# Altium project MCU.PrjPcb
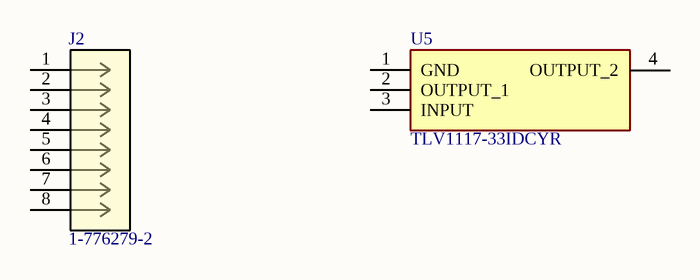
[diagram p0: Power.SchDoc]
4 sheets, 62 parts. Net scope: hierarchical (ports join the sheet entries above them; power ports are global).
Board file: MCU1.PcbDoc
Sheets:
  Power.SchDoc
  MCU.SchDoc
    Designator = STM32.SchDoc
    Designator = Thermistor.SchDoc

## Sheet Power.SchDoc
size A4

### Parts
(Parts that share a designator on the sheet are numbered #1, #2 ... from top to bottom, then left to right.)
J2#1  1-776279-2  [CONN8_776279_TEC]
U5#1  TLV1117-33IDCYR  [SOT230P700X180-4N]

### Nets

Not connected (* = marked no-connect by the designer): J2#1 1 2 3 4 5 6 7 8; U5#1 1(GND) 2(OUTPUT_1) 3(INPUT) 4(OUTPUT_2)

### Library data of the parts
J2#1 = 1-776279-2: 8 POS RIGHT ANGLE HEADER ASSY; Vendor: TE Connectivity; ROWS/CONFIG: 3; PITCH(MM): 0.157; POSITIONS: 8; Built_By: EMA_UL_Team; SourceLibrary: TE_Connectivity-2018-03-16; Copyright: Copyright (C) 2016 Accelerated Designs. All rights reserved; Manufacturer_Part_Number: 1-776279-2; TE_Part_Number: 1-776279-2; PRODUCT: -; Type: DEV; RefDes: RefDes
U5#1 = TLV1117-33IDCYR: Integrated Circuit; Manufacturer_Name: Texas Instruments; Datasheet Link: http://www.ti.com/lit/ds/symlink/tlv1117.pdf?HQS=TI-null-null-digikeymode-df-pf-null-wwe&ts=1590668900314; Height: 1.8mm; Manufacturer_Part_Number: TLV1117-33IDCYR; Arrow Part Number: TLV1117-33IDCYR; Arrow Price/Stock: https://www.arrow.com/en/products/tlv1117-33idcyr/texas-instruments; Mouser Part Number: 595-TLV1117-33IDCYR; Mouser Price/Stock: https://www.mouser.co.uk/ProductDetail/Texas-Instruments/TLV1117-33IDCYR?qs=p6lVfQR1GSoKgp3tAXcW5w%3D%3D

## Sheet MCU.SchDoc
size A
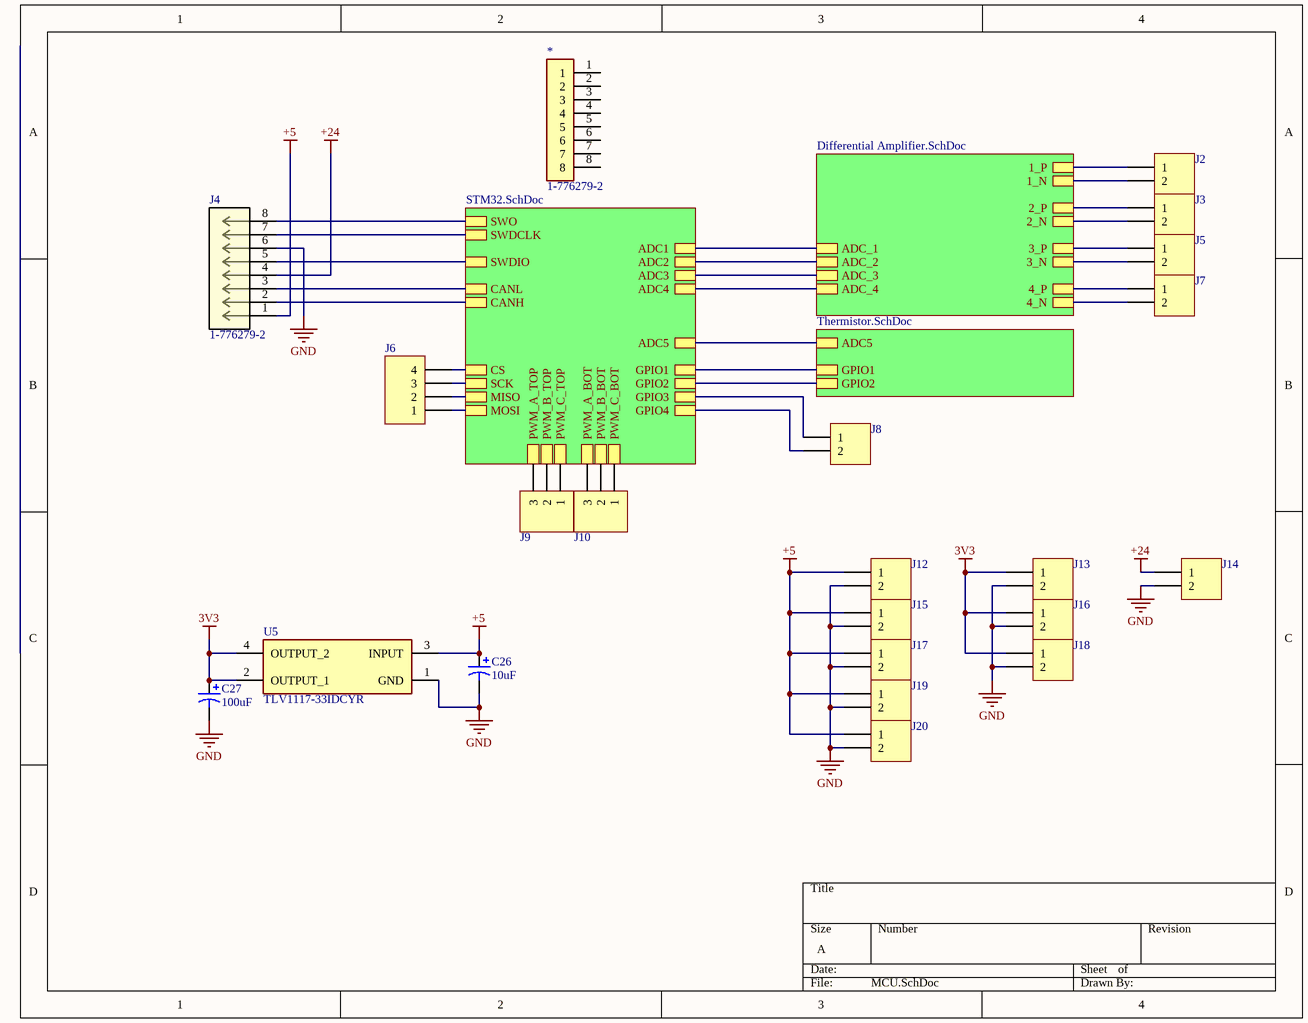
[diagram p1: MCU.SchDoc]

### Parts
(Parts that share a designator on the sheet are numbered #1, #2 ... from top to bottom, then left to right.)
*  1-776279-2  [TE_1-776279-2]
C26  value 10uF  [CAPAE660X800N]  (hidden comment: Cap Pol3)
C27  value 100uF  [CAPAE660X800N]  (hidden comment: Cap Pol3)
J2#2  Header 2  [HDR1X2]  (value not drawn)
J3  Header 2  [HDR1X2]  (value not drawn)
J4  1-776279-2  [CONN8_776279_TEC]
J5  Header 2  [HDR1X2]  (value not drawn)
J6  Header 4  [HDR1X4]  (value not drawn)
J7  Header 2  [HDR1X2]  (value not drawn)
J8  Header 2  [HDR1X2]  (value not drawn)
J9  Header 3  [HDR1X3]  (value not drawn)
J10  Header 3  [HDR1X3]  (value not drawn)
J12  Header 2  [HDR1X2]  (value not drawn)
J13  Header 2  [HDR1X2]  (value not drawn)
J14  Header 2  [HDR1X2]  (value not drawn)
J15  Header 2  [HDR1X2]  (value not drawn)
J16  Header 2  [HDR1X2]  (value not drawn)
J17  Header 2  [HDR1X2]  (value not drawn)
J18  Header 2  [HDR1X2]  (value not drawn)
J19  Header 2  [HDR1X2]  (value not drawn)
J20  Header 2  [HDR1X2]  (value not drawn)
U5#2  TLV1117-33IDCYR  [SOT230P700X180-4N]

### Sub-sheets
Designator = STM32.SchDoc: ADC1, ADC2, ADC3, ADC4, ADC5, CANH, CANL, GPIO1, GPIO4, GPIO3, GPIO2, PWM_B_BOT, PWM_A_BOT, PWM_B_TOP, PWM_C_BOT, PWM_A_TOP, PWM_C_TOP, CS, MISO, SCK, MOSI, SWDIO, SWO, SWDCLK
Designator = Differential Amplifier.SchDoc (file not in this document): ADC_1, ADC_2, ADC_3, ADC_4, 2_N, 2_P, 3_N, 1_N, 4_P, 1_P, 4_N, 3_P
Designator = Thermistor.SchDoc: ADC5, GPIO1, GPIO2

### Nets
3V3: C27.1 J13.1 J16.1 J18.1 U5#2.2(OUTPUT_1) U5#2.4(OUTPUT_2)
+5: C26.1 J4.1 J12.1 J15.1 J17.1 J19.1 J20.1 U5#2.3(INPUT)
+24: J4.4 J14.1
GND: C26.2 C27.2 J4.6 J12.2 J13.2 J14.2 J15.2 J16.2 J17.2 J18.2 J19.2 J20.2 U5#2.1(GND)
NetIC?_1: sheet Designator/GPIO1, sheet Designator/GPIO1
NetIC?_16: sheet Designator/GPIO2, sheet Designator/GPIO2
NetJ2#2_1: J2#2.1 ; sheet Designator/1_P
NetJ2#2_2: J2#2.2 ; sheet Designator/1_N
NetJ3_1: J3.1 ; sheet Designator/2_P
NetJ3_2: J3.2 ; sheet Designator/2_N
NetJ4_2: J4.2 ; sheet Designator/CANH
NetJ4_3: J4.3 ; sheet Designator/CANL
NetJ4_5: J4.5 ; sheet Designator/SWDIO
NetJ4_7: J4.7 ; sheet Designator/SWDCLK
NetJ4_8: J4.8 ; sheet Designator/SWO
NetJ5_1: J5.1 ; sheet Designator/3_P
NetJ5_2: J5.2 ; sheet Designator/3_N
NetJ6_1: J6.1 ; sheet Designator/MOSI
NetJ6_2: J6.2 ; sheet Designator/MISO
NetJ6_3: J6.3 ; sheet Designator/SCK
NetJ6_4: J6.4 ; sheet Designator/CS
NetJ7_1: J7.1 ; sheet Designator/4_P
NetJ7_2: J7.2 ; sheet Designator/4_N
NetJ8_1: J8.1 ; sheet Designator/GPIO3
NetJ8_2: J8.2 ; sheet Designator/GPIO4
NetJ9_1: J9.1 ; sheet Designator/PWM_C_TOP
NetJ9_2: J9.2 ; sheet Designator/PWM_B_TOP
NetJ9_3: J9.3 ; sheet Designator/PWM_A_TOP
NetJ10_1: J10.1 ; sheet Designator/PWM_C_BOT
NetJ10_2: J10.2 ; sheet Designator/PWM_B_BOT
NetJ10_3: J10.3 ; sheet Designator/PWM_A_BOT
NetU2_15: sheet Designator/ADC1, sheet Designator/ADC_1
NetU2_16: sheet Designator/ADC2, sheet Designator/ADC_2
NetU2_17: sheet Designator/ADC3, sheet Designator/ADC_3
NetU2_20: sheet Designator/ADC4, sheet Designator/ADC_4
NetU2_21: sheet Designator/ADC5, sheet Designator/ADC5

Not connected (* = marked no-connect by the designer): * 1 2 3 4 5 6 7 8

### Library data of the parts
C26 C27 = Cap Pol3: Polarized Capacitor (Surface Mount); Published: 8-Jun-2000; LatestRevisionDate: 29-May-2009; LatestRevisionNote: IPC-7351 Footprint Added.; PackageReference: C0805; Publisher: Altium Limited; PackageDescription: Chip Capacitor
J2#2 J3 J5 J7 J8 J12-J20 = Header 2: Header, 2-Pin; LatestRevisionDate: 17-Jul-2002; LatestRevisionNote: Re-released for DXP Platform.; Publisher: Altium Limited
J4 = 1-776279-2: as J2#1 on sheet Power; Copyright: Copyright (C) 2016 Accelerated Designs. All rights reserved; Manufacturer_Part_Number: 1-776279-2; TE_Part_Number: 1-776279-2; PRODUCT: -; Type: DEV; RefDes: RefDes
J6 = Header 4: Header, 4-Pin; LatestRevisionDate: 17-Jul-2002; LatestRevisionNote: Re-released for DXP Platform.; Publisher: Altium Limited
J9 J10 = Header 3: Header, 3-Pin; LatestRevisionDate: 17-Jul-2002; LatestRevisionNote: Re-released for DXP Platform.; Publisher: Altium Limited
U5#2 = TLV1117-33IDCYR: as U5#1 on sheet Power; Datasheet Link: http://www.ti.com/lit/ds/symlink/tlv1117.pdf?HQS=TI-null-null-digikeymode-df-pf-null-wwe&ts=1590668900314; Height: 1.8mm; Manufacturer_Part_Number: TLV1117-33IDCYR; Arrow Part Number: TLV1117-33IDCYR; Arrow Price/Stock: https://www.arrow.com/en/products/tlv1117-33idcyr/texas-instruments; Mouser Part Number: 595-TLV1117-33IDCYR; Mouser Price/Stock: https://www.mouser.co.uk/ProductDetail/Texas-Instruments/TLV1117-33IDCYR?qs=p6lVfQR1GSoKgp3tAXcW5w%3D%3D

## Sheet STM32.SchDoc
size A
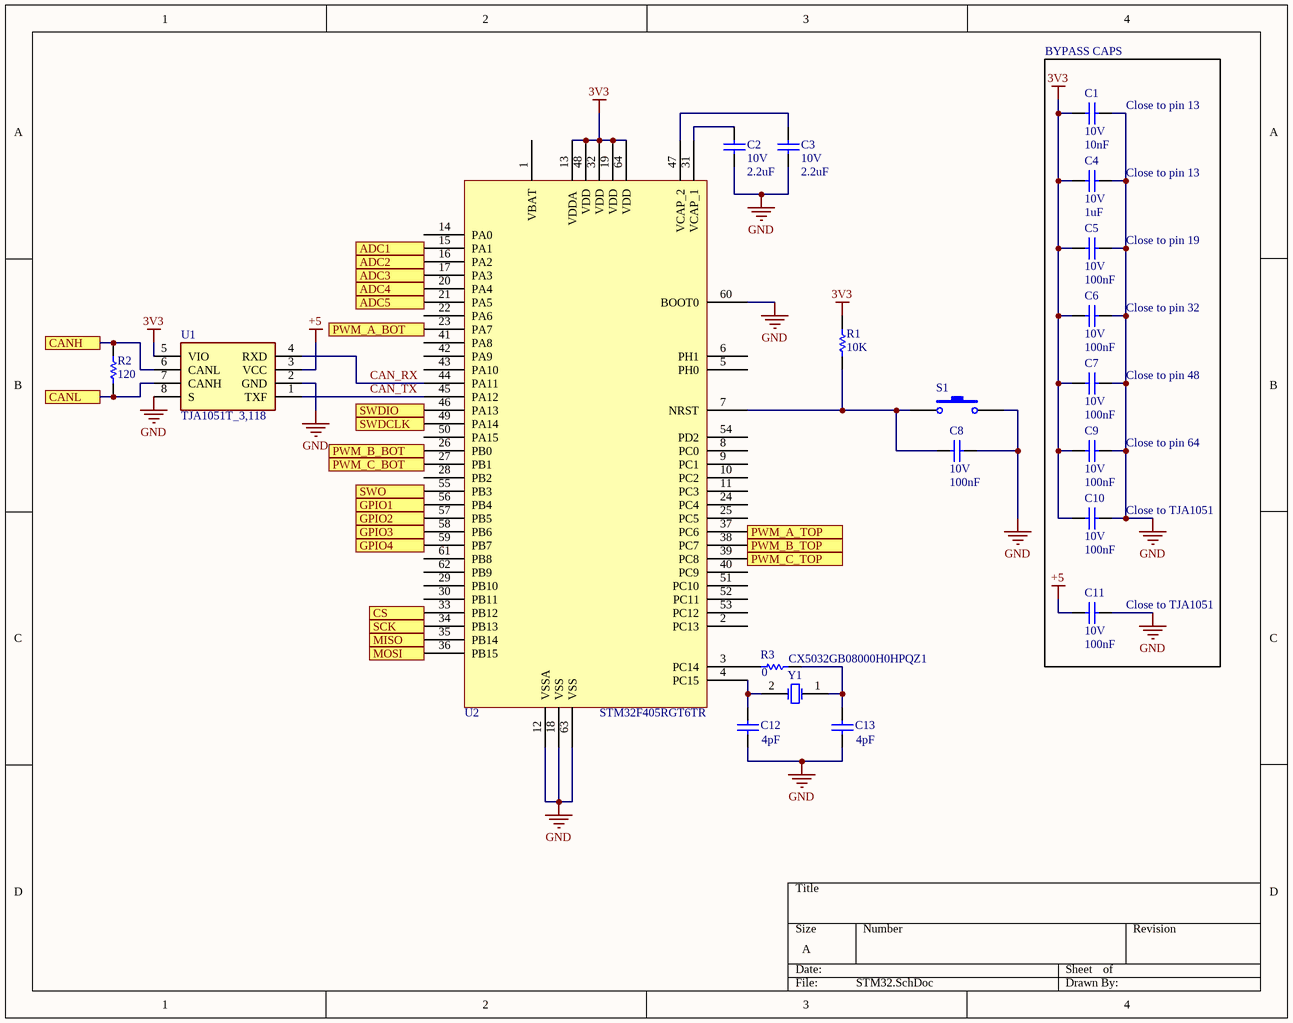
[diagram p2: STM32.SchDoc]

### Parts
C1  10V  value 10nF  [C0805]
C2  10V  value 2.2uF  [C0805]
C3  10V  value 2.2uF  [C0805]
C4  10V  value 1uF  [C0805]
C5  10V  value 100nF  [C0805]
C6  10V  value 100nF  [C0805]
C7  10V  value 100nF  [C0805]
C8  10V  value 100nF  [C0805]
C9  10V  value 100nF  [C0805]
C10  10V  value 100nF  [C0805]
C11  10V  value 100nF  [C0805]
C12  value 4pF  [C0805]  (hidden comment: 50V)
C13  value 4pF  [C0805]  (hidden comment: 50V)
R1  value 10K  [J1-0603]  (hidden comment: 5%)
R2  value 120  [J1-0603]  (hidden comment: 5%)
R3  value 0  [J1-0603]  (hidden comment: 0603)
S1  SW-PB  [PTS636 SM43 SMTR LFS]  (value not drawn)
U1  TJA1051T_3,118  [SOIC127P600X175-8N]
U2  STM32F405RGT6TR  [STM32F405RGT6TR]
Y1  CX5032GB08000H0HPQZ1  [CX5032GB08000H0HPQZ1]

### Ports
ADC1, ADC2, ADC3, ADC4, ADC5, CANH, CANL, CS, GPIO1, GPIO2, GPIO3, GPIO4, MISO, MOSI, PWM_A_BOT, PWM_A_TOP, PWM_B_BOT, PWM_B_TOP, PWM_C_BOT, PWM_C_TOP, SCK, SWDCLK, SWDIO, SWO

### Nets
3V3: C1.1 C4.2 C5.1 C6.1 C7.1 C9.1 C10.1 R1.2 U1.5(VIO) U2.13(VDDA) U2.19(VDD) U2.32(VDD) U2.48(VDD) U2.64(VDD)
+5: C11.1 U1.3(VCC)
GND: C1.2 C2.1 C3.1 C4.1 C5.2 C6.2 C7.2 C8.2 C9.2 C10.2 C11.2 C12.1 C13.1 S1.2 U1.2(GND) U1.8(S) U2.12(VSSA) U2.18(VSS) U2.60(BOOT0) U2.63(VSS)
CAN_RX: U1.4(RXD) U2.44(PA11)
CAN_TX: U1.1(TXF) U2.45(PA12)
NetC2_2: C2.2 U2.31(VCAP_1)
NetC3_2: C3.2 U2.47(VCAP_2)
NetC8_1: C8.1 R1.1 S1.1 U2.7(NRST)
NetC12_2: C12.2 U2.4(PC15) Y1.2(OSC2)
NetC13_2: C13.2 R3.2 Y1.1(OSC1)
NetIC?_1: U2.56(PB4) ; port GPIO1
NetIC?_16: U2.57(PB5) ; port GPIO2
NetJ4_2: R2.2 U1.6(CANL) ; port CANH
NetJ4_3: R2.1 U1.7(CANH) ; port CANL
NetJ4_5: U2.46(PA13) ; port SWDIO
NetJ4_7: U2.49(PA14) ; port SWDCLK
NetJ4_8: U2.55(PB3) ; port SWO
NetJ6_1: U2.36(PB15) ; port MOSI
NetJ6_2: U2.35(PB14) ; port MISO
NetJ6_3: U2.34(PB13) ; port SCK
NetJ6_4: U2.33(PB12) ; port CS
NetJ8_1: U2.58(PB6) ; port GPIO3
NetJ8_2: U2.59(PB7) ; port GPIO4
NetJ9_1: U2.39(PC8) ; port PWM_C_TOP
NetJ9_2: U2.38(PC7) ; port PWM_B_TOP
NetJ9_3: U2.37(PC6) ; port PWM_A_TOP
NetJ10_1: U2.27(PB1) ; port PWM_C_BOT
NetJ10_2: U2.26(PB0) ; port PWM_B_BOT
NetJ10_3: U2.23(PA7) ; port PWM_A_BOT
NetR3_1: R3.1 U2.3(PC14)
NetU2_15: U2.15(PA1) ; port ADC1
NetU2_16: U2.16(PA2) ; port ADC2
NetU2_17: U2.17(PA3) ; port ADC3
NetU2_20: U2.20(PA4) ; port ADC4
NetU2_21: U2.21(PA5) ; port ADC5

Not connected (* = marked no-connect by the designer): U2 1(VBAT) 2(PC13) 5(PH0) 6(PH1) 8(PC0) 9(PC1) 10(PC2) 11(PC3) 14(PA0) 22(PA6) 24(PC4) 25(PC5) 28(PB2) 29(PB10) 30(PB11) 40(PC9) 41(PA8) 42(PA9) 43(PA10) 50(PA15) 51(PC10) 52(PC11) 53(PC12) 54(PD2) 61(PB8) 62(PB9)

### Notes on the sheet
- BYPASS CAPS
- (near C1) Close to pin 13
- (near C4) Close to pin 13
- (near C5) Close to pin 19
- (near C6) Close to pin 32
- (near C7) Close to pin 48
- (near C9) Close to pin 64
- (near C10) Close to TJA1051
- (near C11) Close to TJA1051

### Library data of the parts
C1 = Cap: C0805C103K8RAC7800. 10000pF ±10% 10V Ceramic Capacitor X7R 0805 (2012 Metric) /; Published: 8-Jun-2000; LatestRevisionDate: 17-Jul-2002; LatestRevisionNote: Re-released for DXP Platform.; PackageReference: RAD-0.3; Publisher: Altium Limited; PackageDescription: Radial Cap, Thru-Hole; 2 Leads; 0.3 in Pin Spacing
C2 C3 = Cap: C0805C225K8RACAUTO. 2.2µF ±10% 10V Ceramic Capacitor X7R 0805 (2012 Metric) /; Published: 8-Jun-2000; LatestRevisionDate: 17-Jul-2002; LatestRevisionNote: Re-released for DXP Platform.; PackageReference: RAD-0.3; Publisher: Altium Limited; PackageDescription: Radial Cap, Thru-Hole; 2 Leads; 0.3 in Pin Spacing
C4 = Cap: CL21B105KPFNNNE. 1µF ±10% 10V Ceramic Capacitor X7R 0805 (2012 Metric) /; Published: 8-Jun-2000; LatestRevisionDate: 17-Jul-2002; LatestRevisionNote: Re-released for DXP Platform.; PackageReference: RAD-0.3; Publisher: Altium Limited; PackageDescription: Radial Cap, Thru-Hole; 2 Leads; 0.3 in Pin Spacing
C5-C11 = Cap: C0805C104K8RACTU. 0.1µF ±10% 10V Ceramic Capacitor X7R 0805 (2012 Metric) /; Published: 8-Jun-2000; LatestRevisionDate: 17-Jul-2002; LatestRevisionNote: Re-released for DXP Platform.; PackageReference: RAD-0.3; Publisher: Altium Limited; PackageDescription: Radial Cap, Thru-Hole; 2 Leads; 0.3 in Pin Spacing
C12 = Cap: CBR08C409B5GAC. 4pF ±0.1pF 50V Ceramic Capacitor C0G, NP0 0805 (2012 Metric); Published: 8-Jun-2000; LatestRevisionDate: 17-Jul-2002; LatestRevisionNote: Re-released for DXP Platform.; PackageReference: RAD-0.3; Publisher: Altium Limited; PackageDescription: Radial Cap, Thru-Hole; 2 Leads; 0.3 in Pin Spacing
C13 = Cap: CBR08C409B5GAC; Published: 8-Jun-2000; LatestRevisionDate: 17-Jul-2002; LatestRevisionNote: Re-released for DXP Platform.; PackageReference: RAD-0.3; Publisher: Altium Limited; PackageDescription: Radial Cap, Thru-Hole; 2 Leads; 0.3 in Pin Spacing
R1 R2 = Res1: ERJ-3GEYJ103V. 10 kOhms ±5% 0.1W, 1/10W Chip Resistor 0603 (1608 Metric) Automotive AEC-Q200 Thick Film /; Published: 8-Jun-2000; LatestRevisionDate: 17-Jul-2002; LatestRevisionNote: Re-released for DXP Platform.; PackageReference: AXIAL-0.3; Publisher: Altium Limited; PackageDescription: Axial Device, Thru-Hole; 2 Leads; 0.3 in Pin Spacing
R3 = Res1: ERJ-U030R00V. 0 Ohms Jumper 0.1W, 1/10W Chip Resistor 0603 (1608 Metric) Anti-Sulfur, Automotive AEC-Q200 Thick Film; Published: 8-Jun-2000; LatestRevisionDate: 17-Jul-2002; LatestRevisionNote: Re-released for DXP Platform.; PackageReference: AXIAL-0.3; Publisher: Altium Limited; PackageDescription: Axial Device, Thru-Hole; 2 Leads; 0.3 in Pin Spacing
S1 = SW-PB: Switch; Published: 24-Mar-1999; LatestRevisionDate: 17-Jul-2002; LatestRevisionNote: Re-released for DXP Platform.; PackageReference: SPST-2; Publisher: Altium Limited; PackageDescription: Switch; 2 Leads
U1 = TJA1051T_3,118: Integrated Circuit; Manufacturer_Name: NXP; Manufacturer_Part_Number: TJA1051T/3,118; Datasheet Link: http://www.nxp.com/docs/en/data-sheet/TJA1051.pdf; Height: 1.75mm; Arrow Part Number: TJA1051T/3,118; Arrow Price/Stock: https://www.arrow.com/en/products/tja1051t3118/nxp-semiconductors; Mouser Part Number: 771-TJA1051T3118; Mouser Price/Stock: https://www.mouser.co.uk/ProductDetail/NXP-Semiconductors/TJA1051T-3118?qs=O%2F7ihdSJpebv1PFlp05wnQ%3D%3D
Y1 = XTAL: 8MHz ±20ppm Crystal 12pF 300 Ohms 2-SMD, No Lead /; Published: 8-Jun-2000; LatestRevisionDate: 17-Jul-2002; LatestRevisionNote: Re-released for DXP Platform.; PackageReference: R38; Publisher: Altium Limited; PackageDescription: Crystal, Thru-Hole; 2 Leads; Body 3.1 x 8.2 mm (Dia.xH)

## Sheet Thermistor.SchDoc
size A4
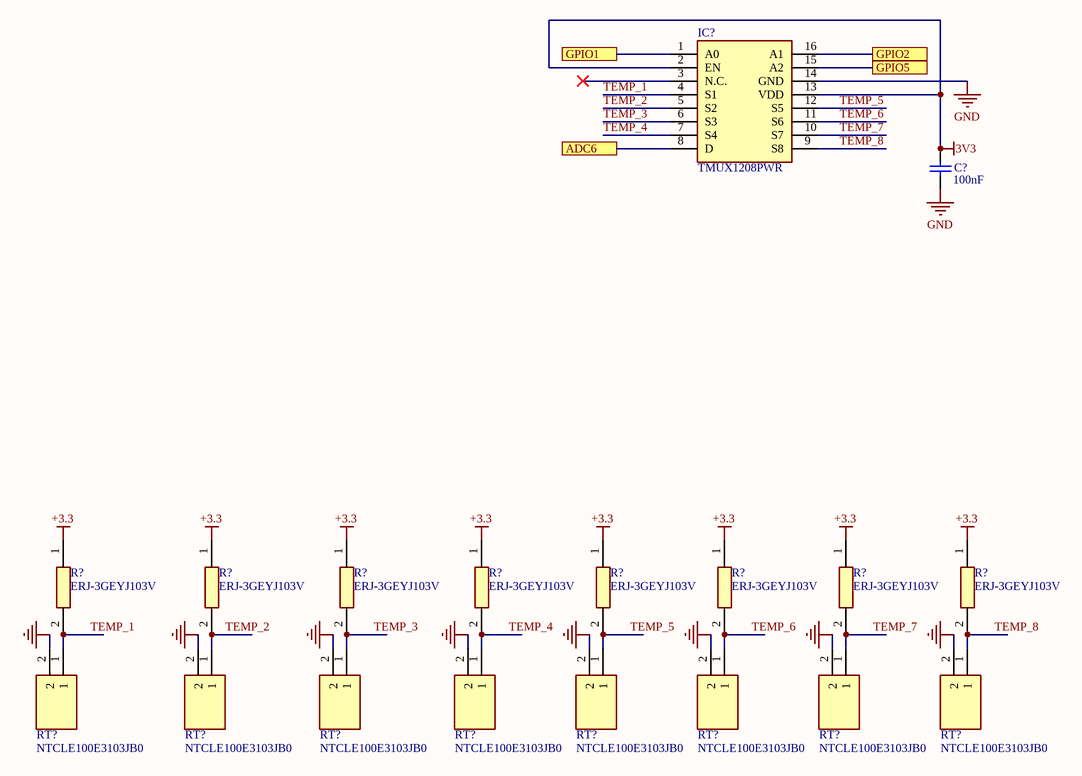
[diagram p3: Thermistor.SchDoc]

### Parts
(Parts that share a designator on the sheet are numbered #1, #2 ... from top to bottom, then left to right.)
C?  value 100nF  [C0805]  (hidden comment: 10V)
IC?  TMUX1208PWR  [SOP65P640X120-16N]
R?#1  ERJ-3GEYJ103V  [RESC1608X55N]
R?#2  ERJ-3GEYJ103V  [RESC1608X55N]
R?#3  ERJ-3GEYJ103V  [RESC1608X55N]
R?#4  ERJ-3GEYJ103V  [RESC1608X55N]
R?#5  ERJ-3GEYJ103V  [RESC1608X55N]
R?#6  ERJ-3GEYJ103V  [RESC1608X55N]
R?#7  ERJ-3GEYJ103V  [RESC1608X55N]
R?#8  ERJ-3GEYJ103V  [RESC1608X55N]
RT?#1  NTCLE100E3103JB0  [NTCLE100E3103JB0]
RT?#2  NTCLE100E3103JB0  [NTCLE100E3103JB0]
RT?#3  NTCLE100E3103JB0  [NTCLE100E3103JB0]
RT?#4  NTCLE100E3103JB0  [NTCLE100E3103JB0]
RT?#5  NTCLE100E3103JB0  [NTCLE100E3103JB0]
RT?#6  NTCLE100E3103JB0  [NTCLE100E3103JB0]
RT?#7  NTCLE100E3103JB0  [NTCLE100E3103JB0]
RT?#8  NTCLE100E3103JB0  [NTCLE100E3103JB0]

### Ports
ADC6, GPIO1, GPIO2, GPIO5

### Nets
3V3: C?.1 IC?.2(EN) IC?.13(VDD)
+3.3: R?#1.1 R?#2.1 R?#3.1 R?#4.1 R?#5.1 R?#6.1 R?#7.1 R?#8.1
GND: C?.2 IC?.14(GND)
NetRT?#1_2: RT?#1.2 RT?#2.2 RT?#3.2 RT?#4.2 RT?#5.2 RT?#6.2 RT?#7.2 RT?#8.2
TEMP_1: IC?.4(S1) R?#1.2 RT?#1.1
TEMP_2: IC?.5(S2) R?#2.2 RT?#2.1
TEMP_3: IC?.6(S3) R?#3.2 RT?#3.1
TEMP_4: IC?.7(S4) R?#4.2 RT?#4.1
TEMP_5: IC?.12(S5) R?#5.2 RT?#5.1
TEMP_6: IC?.11(S6) R?#6.2 RT?#6.1
TEMP_7: IC?.10(S7) R?#7.2 RT?#7.1
TEMP_8: IC?.9(S8) R?#8.2 RT?#8.1
NetIC?_1: IC?.1(A0) ; port GPIO1
NetIC?_8: IC?.8(D) ; port ADC6
NetIC?_15: IC?.15(A2) ; port GPIO5
NetIC?_16: IC?.16(A1) ; port GPIO2

Not connected (* = marked no-connect by the designer): IC? 3(N.C.)*

### Library data of the parts
C? = Cap: as C5 on sheet STM32; Published: 8-Jun-2000; LatestRevisionDate: 17-Jul-2002; LatestRevisionNote: Re-released for DXP Platform.; PackageReference: RAD-0.3; Publisher: Altium Limited; PackageDescription: Radial Cap, Thru-Hole; 2 Leads; 0.3 in Pin Spacing
IC? = TMUX1208PWR: Integrated Circuit; Manufacturer_Name: Texas Instruments; Datasheet Link: http://www.ti.com/lit/gpn/tmux1208; Height: 1.2mm; Manufacturer_Part_Number: TMUX1208PWR; Mouser Part Number: 595-TMUX1208PWR; Mouser Price/Stock: https://www.mouser.co.uk/ProductDetail/Texas-Instruments/TMUX1208PWR/?qs=lc2O%252BfHJPVbYdIGs2%2FdugA%3D%3D; Arrow Part Number: TMUX1208PWR; Arrow Price/Stock: https://www.arrow.com/en/products/tmux1208pwr/texas-instruments
R?#1-R?#8 = ERJ-3GEYJ103V: Resistor; Manufacturer_Name: Panasonic; Datasheet Link: http://docs-emea.rs-online.com/webdocs/13ba/0900766b813ba21b.pdf; Height: 0.55mm; Manufacturer_Part_Number: ERJ-3GEYJ103V; Mouser Part Number: 667-ERJ-3GEYJ103V; Mouser Price/Stock: https://www.mouser.co.uk/ProductDetail/Panasonic/ERJ-3GEYJ103V/?qs=66DK8nO8gJBWgc%252B0VNNxzg%3D%3D; Arrow Part Number: ERJ-3GEYJ103V; Arrow Price/Stock: https://www.arrow.com/en/products/erj-3geyj103v/panasonic
RT?#1-RT?#8 = NTCLE100E3103JB0: Thermistor; Manufacturer_Name: Vishay; Datasheet Link: https://www.mouser.com/datasheet/2/427/ntcle100-222385.pdf; Height: 10mm; Manufacturer_Part_Number: NTCLE100E3103JB0; Mouser Part Number: 594-2381-640-63103; Mouser Price/Stock: https://www.mouser.co.uk/ProductDetail/Vishay-BC-Components/NTCLE100E3103JB0/?qs=MSh2oj3GFQcs%2FteGkdbngw%3D%3D; Arrow Part Number: NTCLE100E3103JB0; Arrow Price/Stock: https://www.arrow.com/en/products/ntcle100e3103jb0/vishay

## Nets that join several sheets
3V3: MCU (6 pins), STM32 (14 pins), Thermistor (C?.1 IC?.2 IC?.13)
+5: MCU (8 pins), STM32 (C11.1 U1.3)
GND: MCU (13 pins), STM32 (20 pins), Thermistor (C?.2 IC?.14)
NetIC?_1: STM32 (U2.56), Thermistor (IC?.1)
NetIC?_16: STM32 (U2.57), Thermistor (IC?.16)
NetJ4_2: MCU (J4.2), STM32 (R2.2 U1.6)
NetJ4_3: MCU (J4.3), STM32 (R2.1 U1.7)
NetJ4_5: MCU (J4.5), STM32 (U2.46)
NetJ4_7: MCU (J4.7), STM32 (U2.49)
NetJ4_8: MCU (J4.8), STM32 (U2.55)
NetJ6_1: MCU (J6.1), STM32 (U2.36)
NetJ6_2: MCU (J6.2), STM32 (U2.35)
NetJ6_3: MCU (J6.3), STM32 (U2.34)
NetJ6_4: MCU (J6.4), STM32 (U2.33)
NetJ8_1: MCU (J8.1), STM32 (U2.58)
NetJ8_2: MCU (J8.2), STM32 (U2.59)
NetJ9_1: MCU (J9.1), STM32 (U2.39)
NetJ9_2: MCU (J9.2), STM32 (U2.38)
NetJ9_3: MCU (J9.3), STM32 (U2.37)
NetJ10_1: MCU (J10.1), STM32 (U2.27)
NetJ10_2: MCU (J10.2), STM32 (U2.26)
NetJ10_3: MCU (J10.3), STM32 (U2.23)